# EAGLE design BigTimeBottom (EAGLE 7.6.0)
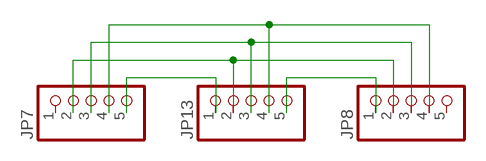
[diagram p0: schematic, sheet 1]

## Parts
JP7  HEADER-1X576MIL  [1X05_ROUND_76]
JP8  HEADER-1X576MIL  [1X05_ROUND_76]
JP13  HEADER-1X576MIL  [1X05_ROUND_76]

## Nets
N$2: JP7.5 JP13.1
N$5: JP8.1 JP13.5
N$8: JP7.2 JP8.2 JP13.2
N$10: JP7.4 JP8.4 JP13.4
W1: JP7.3 JP8.3 JP13.3
Unconnected: JP7.1 JP8.5

## Library data of the parts
JP7 JP8 JP13 = microbuilder:HEADER-1X5: PIN HEADER

## Board
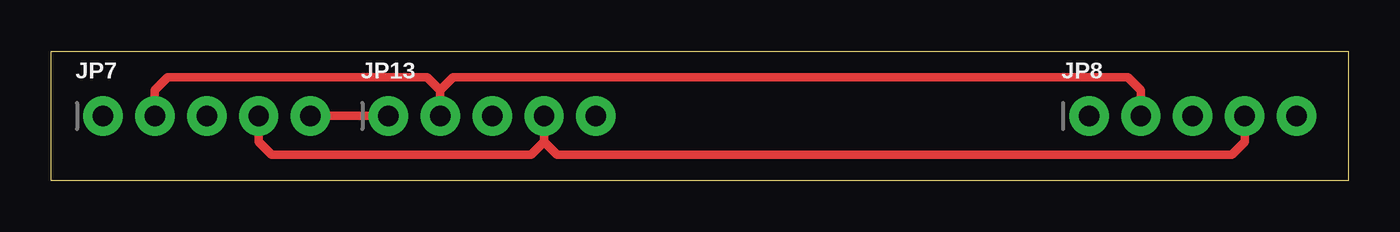
[diagram p1: board, top side]
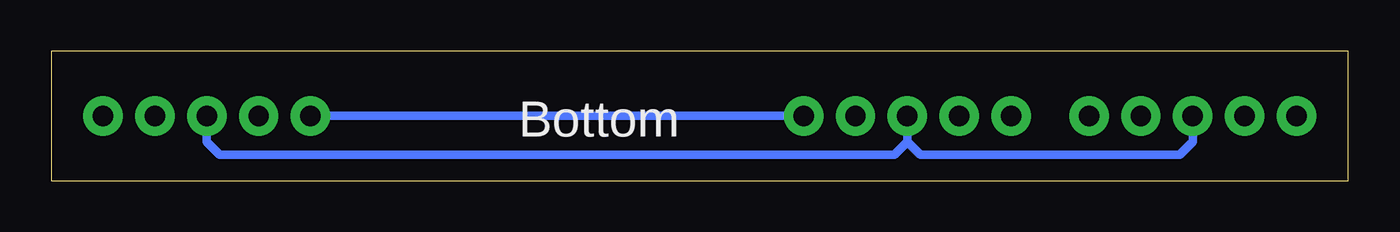
[diagram p2: board, bottom side, seen from below]

Size 63.5 x 6.35 mm. Coordinates in mm from the lower left corner, seen from the top.
Outline: 0,0 0,6.35 63.5,6.35 63.5,0 0,0
Copper layers (1*16): Top 0.035mm / dielectric 1.5mm / Bottom 0.035mm
Design rules "default *": minimum track width 8mil, minimum drill 15.5mil, track to track 8mil, track to pad 8mil, pad to pad 8mil, via to via 8mil, smd to smd 8mil, copper to edge 10mil, drill to drill 8mil, minimum pad ring 10mil, minimum via ring 8mil, stop-mask expansion 2mil, vias tented up to drill 20mil, thermal gap 10mil

### Footprints (pad centres in the part's own frame; a part is rotated, then mirrored left to right if it is on the bottom)
1X05_ROUND_76 = drill 1 pad 1.93: 1 -5.08,0; 2 -2.54,0; 3 0,0; 4 2.54,0; 5 5.08,0

### Placement (x,y rotation side)
JP7  7.62,3.17 0 top
JP8  55.88,3.17 0 top
JP13  21.59,3.17 0 top

### Tracks (layer width: path | path; a pad name or v marks a point on that pad's centre or on a via)
N$2
  Top 0.406: JP13.1 JP7.5
N$5
  Bottom 0.406: JP13.5 JP8.1
N$8
  Top 0.406: JP13.2 19.05,4.45 | JP8.2 53.34,4.45 52.7,5.08 19.68,5.08 19.05,4.45 | JP7.2 5.08,4.45 5.71,5.08 18.41,5.08 19.05,4.45
N$10
  Top 0.406: JP7.4 10.16,1.91 10.79,1.27 23.5,1.27 24.13,1.91 | JP13.4 24.13,1.91 | 24.13,1.91 24.77,1.27 57.78,1.27 58.42,1.91 JP8.4
W1
  Bottom 0.406: JP7.3 7.62,1.91 8.26,1.27 20.95,1.27 21.59,1.91 | JP13.3 21.59,1.91 | 21.59,1.91 22.23,1.27 55.24,1.27 55.88,1.91 JP8.3

### Text on the board
bPlace: Bottom